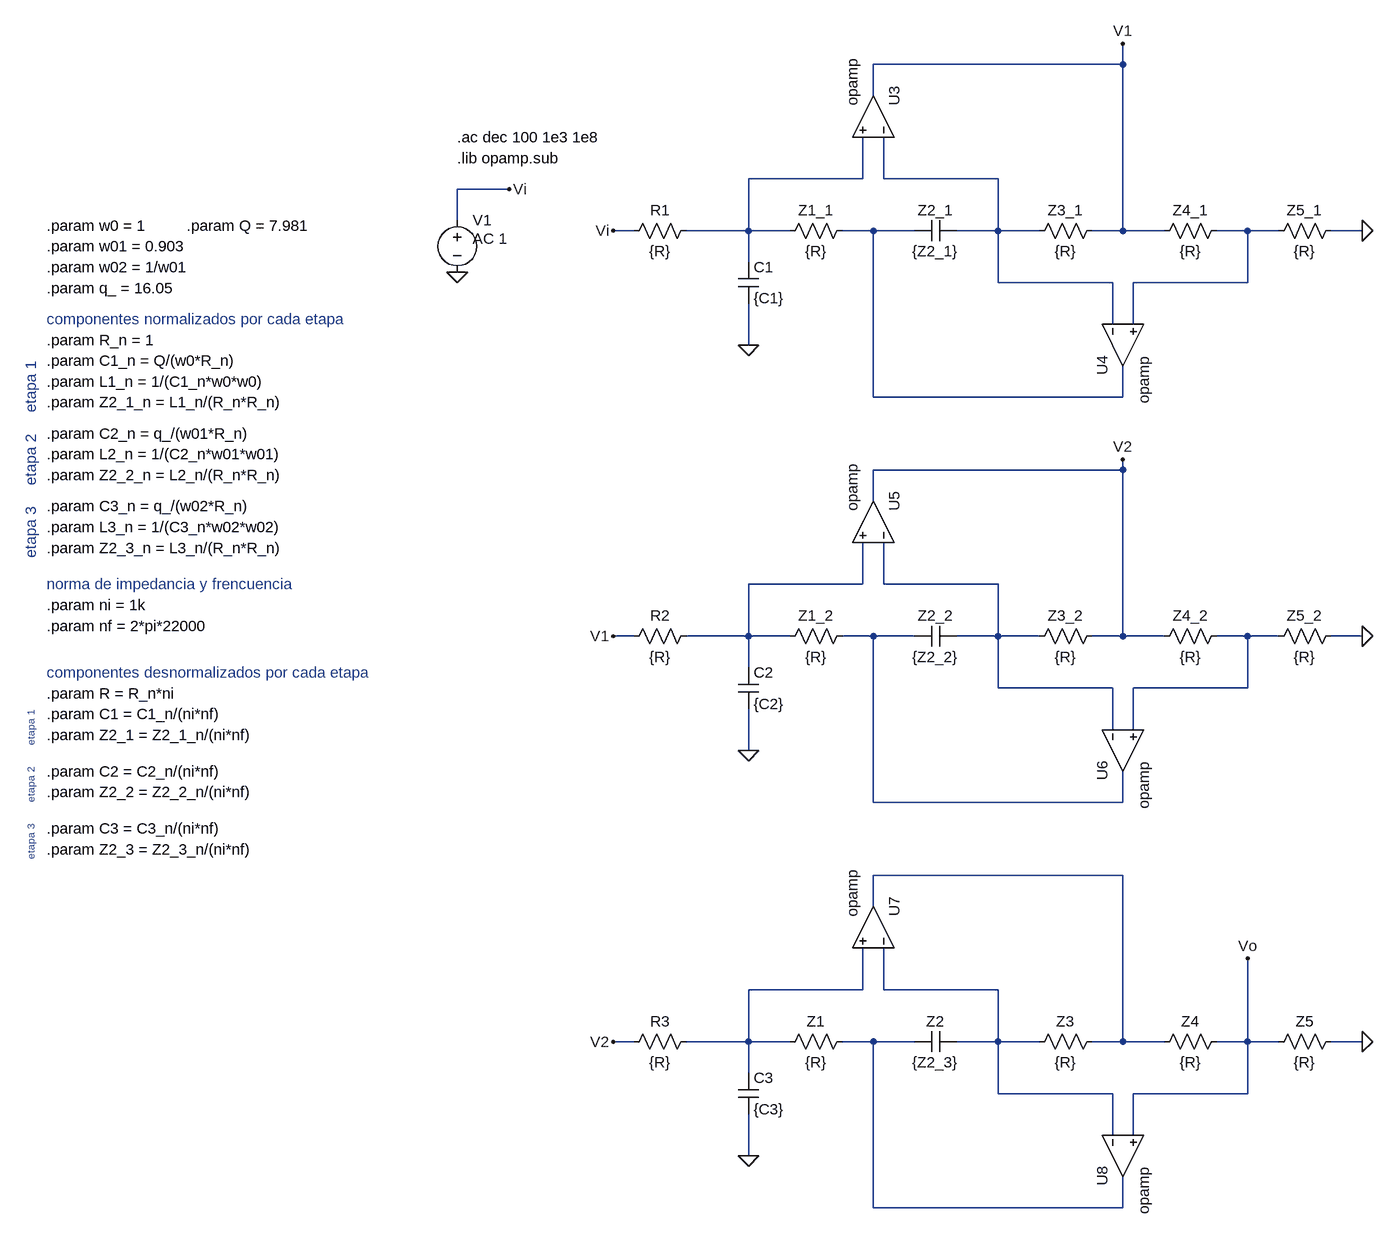
[diagram p0: schematic TPS4bis²_activo.asc]
TPS4bis²_activo.asc, the LTspice schematic file:
Version 4
SHEET 1 880 964
WIRE 32 -800 32 -832
WIRE 32 -800 -352 -800
WIRE -352 -752 -352 -800
WIRE -368 -624 -368 -688
WIRE -368 -624 -544 -624
WIRE -336 -624 -336 -688
WIRE -160 -624 -336 -624
WIRE -912 -608 -992 -608
WIRE -992 -560 -992 -608
WIRE -720 -544 -752 -544
WIRE -544 -544 -544 -624
WIRE -544 -544 -640 -544
WIRE -480 -544 -544 -544
WIRE -352 -544 -400 -544
WIRE -288 -544 -352 -544
WIRE -160 -544 -160 -624
WIRE -160 -544 -224 -544
WIRE -96 -544 -160 -544
WIRE 32 -544 32 -800
WIRE 32 -544 -16 -544
WIRE 96 -544 32 -544
WIRE 224 -544 176 -544
WIRE 272 -544 224 -544
WIRE 400 -544 352 -544
WIRE -544 -496 -544 -544
WIRE -160 -464 -160 -544
WIRE 16 -464 -160 -464
WIRE 224 -464 224 -544
WIRE 224 -464 48 -464
WIRE 16 -400 16 -464
WIRE 48 -400 48 -464
WIRE -544 -368 -544 -432
WIRE -352 -288 -352 -544
WIRE 32 -288 32 -336
WIRE 32 -288 -352 -288
WIRE 32 -176 32 -192
WIRE 32 -176 -352 -176
WIRE -352 -128 -352 -176
WIRE -368 0 -368 -64
WIRE -368 0 -544 0
WIRE -336 0 -336 -64
WIRE -160 0 -336 0
WIRE -720 80 -752 80
WIRE -544 80 -544 0
WIRE -544 80 -640 80
WIRE -480 80 -544 80
WIRE -352 80 -400 80
WIRE -288 80 -352 80
WIRE -160 80 -160 0
WIRE -160 80 -224 80
WIRE -96 80 -160 80
WIRE 32 80 32 -176
WIRE 32 80 -16 80
WIRE 96 80 32 80
WIRE 224 80 176 80
WIRE 272 80 224 80
WIRE 400 80 352 80
WIRE -544 128 -544 80
WIRE -160 160 -160 80
WIRE 16 160 -160 160
WIRE 224 160 224 80
WIRE 224 160 48 160
WIRE 16 224 16 160
WIRE 48 224 48 160
WIRE -544 256 -544 192
WIRE -352 336 -352 80
WIRE 32 336 32 288
WIRE 32 336 -352 336
WIRE 32 448 -352 448
WIRE -352 496 -352 448
WIRE -368 624 -368 560
WIRE -368 624 -544 624
WIRE -336 624 -336 560
WIRE -160 624 -336 624
WIRE -720 704 -752 704
WIRE -544 704 -544 624
WIRE -544 704 -640 704
WIRE -480 704 -544 704
WIRE -352 704 -400 704
WIRE -288 704 -352 704
WIRE -160 704 -160 624
WIRE -160 704 -224 704
WIRE -96 704 -160 704
WIRE 32 704 32 448
WIRE 32 704 -16 704
WIRE 96 704 32 704
WIRE 224 704 224 576
WIRE 224 704 176 704
WIRE 272 704 224 704
WIRE 400 704 352 704
WIRE -544 752 -544 704
WIRE -160 784 -160 704
WIRE 16 784 -160 784
WIRE 224 784 224 704
WIRE 224 784 48 784
WIRE 16 848 16 784
WIRE 48 848 48 784
WIRE -544 880 -544 816
WIRE -352 960 -352 704
WIRE 32 960 32 912
WIRE 32 960 -352 960
FLAG -752 -544 Vi
FLAG 32 -832 V1
FLAG -992 -480 0
FLAG -912 -608 Vi
FLAG 32 -192 V2
FLAG -752 80 V1
FLAG -752 704 V2
FLAG -544 -368 0
FLAG 400 -544 0
FLAG -544 256 0
FLAG 400 80 0
FLAG 400 704 0
FLAG -544 880 0
FLAG 224 576 Vo
SYMBOL res -624 -560 R90
WINDOW 0 0 56 VBottom 2
WINDOW 3 32 56 VTop 2
SYMATTR InstName R1
SYMATTR Value {R}
SYMBOL cap -560 -496 R0
SYMATTR InstName C1
SYMATTR Value {C1}
SYMBOL res -624 64 R90
WINDOW 0 0 56 VBottom 2
WINDOW 3 32 56 VTop 2
SYMATTR InstName R2
SYMATTR Value {R}
SYMBOL cap -560 128 R0
SYMATTR InstName C2
SYMATTR Value {C2}
SYMBOL res -624 688 R90
WINDOW 0 0 56 VBottom 2
WINDOW 3 32 56 VTop 2
SYMATTR InstName R3
SYMATTR Value {R}
SYMBOL cap -560 752 R0
SYMATTR InstName C3
SYMATTR Value {C3}
SYMBOL voltage -992 -576 R0
WINDOW 123 24 44 Left 2
WINDOW 39 0 0 Left 2
SYMATTR Value2 AC 1
SYMATTR InstName V1
SYMATTR Value ""
SYMBOL res -384 -560 R90
WINDOW 0 0 56 VBottom 2
WINDOW 3 32 56 VTop 2
SYMATTR InstName Z1_1
SYMATTR Value {R}
SYMBOL cap -224 -560 R90
WINDOW 0 0 32 VBottom 2
WINDOW 3 32 32 VTop 2
SYMATTR InstName Z2_1
SYMATTR Value {Z2_1}
SYMBOL res 0 -560 R90
WINDOW 0 0 56 VBottom 2
WINDOW 3 32 56 VTop 2
SYMATTR InstName Z3_1
SYMATTR Value {R}
SYMBOL res 192 -560 R90
WINDOW 0 0 56 VBottom 2
WINDOW 3 32 56 VTop 2
SYMATTR InstName Z4_1
SYMATTR Value {R}
SYMBOL res 368 -560 R90
WINDOW 0 0 56 VBottom 2
WINDOW 3 32 56 VTop 2
SYMATTR InstName Z5_1
SYMATTR Value {R}
SYMBOL Opamps\\opamp -288 -720 M270
SYMATTR InstName U3
SYMBOL Opamps\\opamp -32 -368 M90
SYMATTR InstName U4
SYMBOL res -384 64 R90
WINDOW 0 0 56 VBottom 2
WINDOW 3 32 56 VTop 2
SYMATTR InstName Z1_2
SYMATTR Value {R}
SYMBOL cap -224 64 R90
WINDOW 0 0 32 VBottom 2
WINDOW 3 32 32 VTop 2
SYMATTR InstName Z2_2
SYMATTR Value {Z2_2}
SYMBOL res 0 64 R90
WINDOW 0 0 56 VBottom 2
WINDOW 3 32 56 VTop 2
SYMATTR InstName Z3_2
SYMATTR Value {R}
SYMBOL res 192 64 R90
WINDOW 0 0 56 VBottom 2
WINDOW 3 32 56 VTop 2
SYMATTR InstName Z4_2
SYMATTR Value {R}
SYMBOL res 368 64 R90
WINDOW 0 0 56 VBottom 2
WINDOW 3 32 56 VTop 2
SYMATTR InstName Z5_2
SYMATTR Value {R}
SYMBOL Opamps\\opamp -288 -96 M270
SYMATTR InstName U5
SYMBOL Opamps\\opamp -32 256 M90
SYMATTR InstName U6
SYMBOL res -384 688 R90
WINDOW 0 0 56 VBottom 2
WINDOW 3 32 56 VTop 2
SYMATTR InstName Z1
SYMATTR Value {R}
SYMBOL cap -224 688 R90
WINDOW 0 0 32 VBottom 2
WINDOW 3 32 32 VTop 2
SYMATTR InstName Z2
SYMATTR Value {Z2_3}
SYMBOL res 0 688 R90
WINDOW 0 0 56 VBottom 2
WINDOW 3 32 56 VTop 2
SYMATTR InstName Z3
SYMATTR Value {R}
SYMBOL res 192 688 R90
WINDOW 0 0 56 VBottom 2
WINDOW 3 32 56 VTop 2
SYMATTR InstName Z4
SYMATTR Value {R}
SYMBOL res 368 688 R90
WINDOW 0 0 56 VBottom 2
WINDOW 3 32 56 VTop 2
SYMATTR InstName Z5
SYMATTR Value {R}
SYMBOL Opamps\\opamp -288 528 M270
SYMATTR InstName U7
SYMBOL Opamps\\opamp -32 880 M90
SYMATTR InstName U8
TEXT -992 -688 Left 2 !.ac dec 100 1e3 1e8
TEXT -992 -656 Left 2 !.lib opamp.sub
TEXT -1624 -552 Left 2 !.param w0 = 1
TEXT -1624 -376 Left 2 !.param R_n = 1
TEXT -1624 -344 Left 2 !.param C1_n = Q/(w0*R_n)
TEXT -1408 -552 Left 2 !.param Q = 7.981
TEXT -1624 -520 Left 2 !.param w01 = 0.903
TEXT -1624 -488 Left 2 !.param w02 = 1/w01
TEXT -1624 -456 Left 2 !.param q_ = 16.05
TEXT -1624 -280 Left 2 !.param Z2_1_n = L1_n/(R_n*R_n)
TEXT -1624 -232 Left 2 !.param C2_n = q_/(w01*R_n)
TEXT -1624 -168 Left 2 !.param Z2_2_n = L2_n/(R_n*R_n)
TEXT -1624 -120 Left 2 !.param C3_n = q_/(w02*R_n)
TEXT -1624 -56 Left 2 !.param Z2_3_n = L3_n/(R_n*R_n)
TEXT -1624 32 Left 2 !.param ni = 1k
TEXT -1624 64 Left 2 !.param nf = 2*pi*22000
TEXT -1624 168 Left 2 !.param R = R_n*ni
TEXT -1624 200 Left 2 !.param C1 = C1_n/(ni*nf)
TEXT -1624 232 Left 2 !.param Z2_1 = Z2_1_n/(ni*nf)
TEXT -1624 288 Left 2 !.param C2 = C2_n/(ni*nf)
TEXT -1624 320 Left 2 !.param Z2_2 = Z2_2_n/(ni*nf)
TEXT -1624 376 Left 2 !.param C3 = C3_n/(ni*nf)
TEXT -1624 408 Left 2 !.param Z2_3 = Z2_3_n/(ni*nf)
TEXT -1624 -312 Left 2 !.param L1_n = 1/(C1_n*w0*w0)
TEXT -1624 -200 Left 2 !.param L2_n = 1/(C2_n*w01*w01)
TEXT -1624 -88 Left 2 !.param L3_n = 1/(C3_n*w02*w02)
TEXT -1624 -408 Left 2 ;componentes normalizados por cada etapa
TEXT -1648 -264 VLeft 2 ;etapa 1
TEXT -1648 -152 VLeft 2 ;etapa 2
TEXT -1648 -40 VLeft 2 ;etapa 3
TEXT -1624 0 Left 2 ;norma de impedancia y frencuencia
TEXT -1624 136 Left 2 ;componentes desnormalizados por cada etapa
TEXT -1648 248 VLeft 1 ;etapa 1
TEXT -1648 336 VLeft 1 ;etapa 2
TEXT -1648 424 VLeft 1 ;etapa 3

The netlist it stands for:
* TPS4bis²_activo.asc
R1 N001 Vi {R}
C1 N001 0 {C1}
R2 N005 V1 {R}
C2 N005 0 {C2}
R3 N010 V2 {R}
C3 N010 0 {C3}
V1 Vi 0 AC 1
R§Z1_1 N003 N001 {R}
C§Z2_1 N002 N003 {Z2_1}
R§Z3_1 V1 N002 {R}
R§Z4_1 N004 V1 {R}
R§Z5_1 0 N004 {R}
XU3 N002 N001 V1 opamp Aol=100K GBW=10Meg  ; pins invin noninvin out
XU4 N002 N004 N003 opamp Aol=100K GBW=10Meg  ; pins invin noninvin out
R§Z1_2 N007 N005 {R}
C§Z2_2 N006 N007 {Z2_2}
R§Z3_2 V2 N006 {R}
R§Z4_2 N008 V2 {R}
R§Z5_2 0 N008 {R}
XU5 N006 N005 V2 opamp Aol=100K GBW=10Meg  ; pins invin noninvin out
XU6 N006 N008 N007 opamp Aol=100K GBW=10Meg  ; pins invin noninvin out
R§Z1 N012 N010 {R}
C§Z2 N011 N012 {Z2_3}
R§Z3 N009 N011 {R}
R§Z4 Vo N009 {R}
R§Z5 0 Vo {R}
XU7 N011 N010 N009 opamp Aol=100K GBW=10Meg  ; pins invin noninvin out
XU8 N011 Vo N012 opamp Aol=100K GBW=10Meg  ; pins invin noninvin out
.ac dec 100 1e3 1e8
.lib opamp.sub
.param w0 = 1
.param R_n = 1
.param C1_n = Q/(w0*R_n)
.param Q = 7.981
.param w01 = 0.903
.param w02 = 1/w01
.param q_ = 16.05
.param Z2_1_n = L1_n/(R_n*R_n)
.param C2_n = q_/(w01*R_n)
.param Z2_2_n = L2_n/(R_n*R_n)
.param C3_n = q_/(w02*R_n)
.param Z2_3_n = L3_n/(R_n*R_n)
.param ni = 1k
.param nf = 2*pi*22000
.param R = R_n*ni
.param C1 = C1_n/(ni*nf)
.param Z2_1 = Z2_1_n/(ni*nf)
.param C2 = C2_n/(ni*nf)
.param Z2_2 = Z2_2_n/(ni*nf)
.param C3 = C3_n/(ni*nf)
.param Z2_3 = Z2_3_n/(ni*nf)
.param L1_n = 1/(C1_n*w0*w0)
.param L2_n = 1/(C2_n*w01*w01)
.param L3_n = 1/(C3_n*w02*w02)
* componentes normalizados por cada etapa
* etapa 1
* etapa 2
* etapa 3
* norma de impedancia y frencuencia
* componentes desnormalizados por cada etapa
* etapa 1
* etapa 2
* etapa 3
.backanno
.end

* Results of the author's LTspice run, read from the files saved beside the schematic
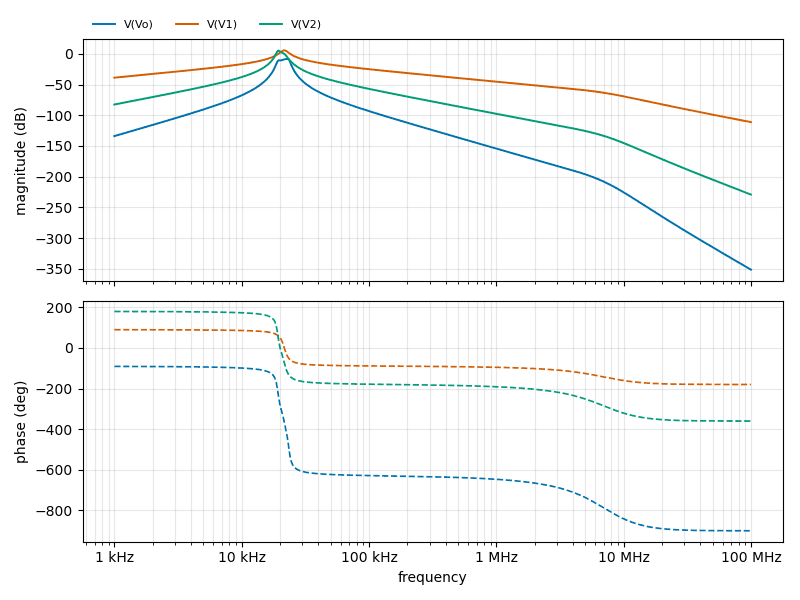
[diagram p1: AC Analysis of TPS4bis²_activo.asc, plotted from the saved traces]
* AC Analysis, 1 run:
*   V(Vo): -133.95 dB at 1 kHz, -351.60 dB at 100 MHz, peak -8.08 dB at 22.91 kHz, 3 dB below the peak at 19.33 kHz and 23.74 kHz
*   V(V1): -38.70 dB at 1 kHz, -111.15 dB at 100 MHz, peak 5.73 dB at 21.38 kHz, 3 dB below the peak at 20.24 kHz and 23.09 kHz
*   V(V2): -82.45 dB at 1 kHz, -229.25 dB at 100 MHz, peak 5.37 dB at 19.5 kHz, 3 dB below the peak at 18.85 kHz and 20.59 kHz